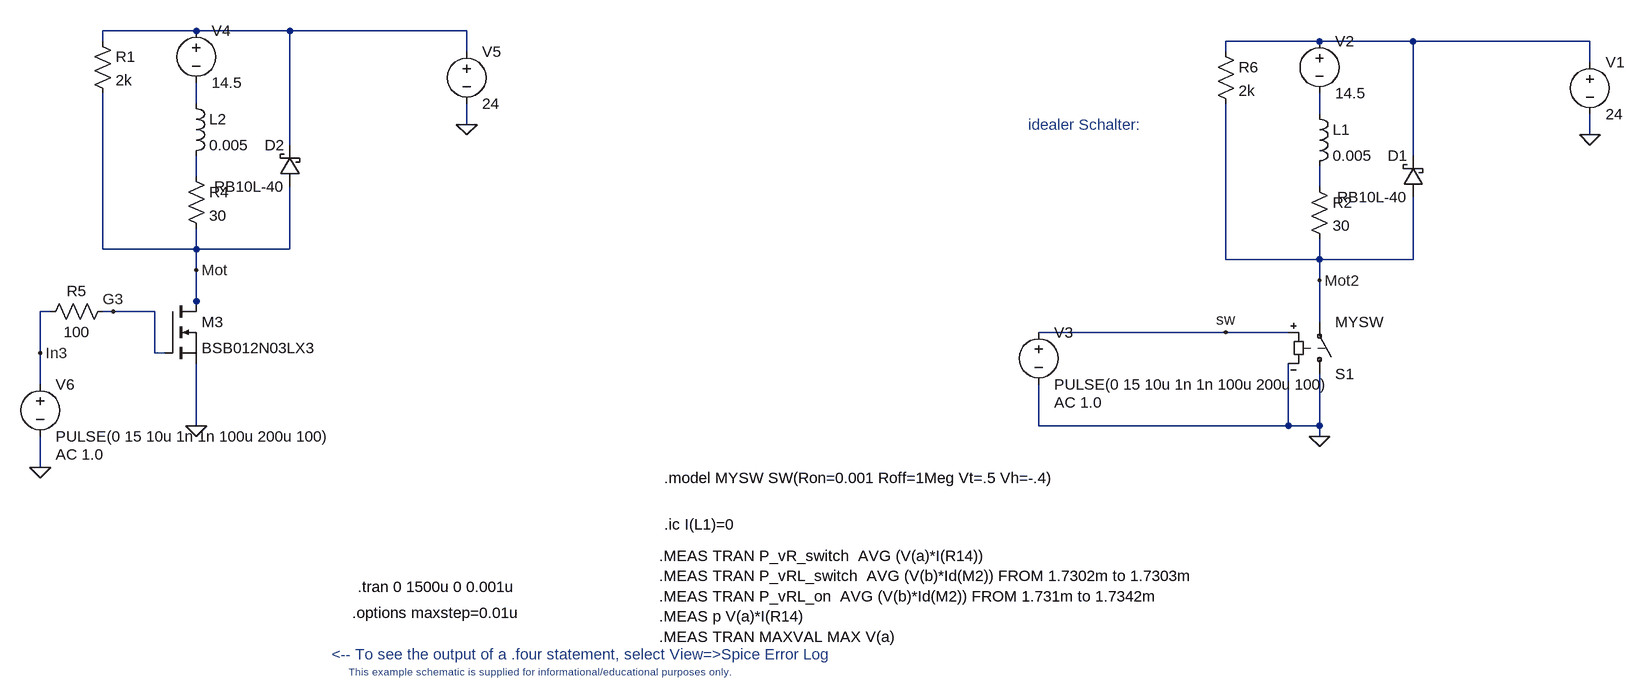
[diagram p0: schematic FetSwitchMotFH1.asc]
FetSwitchMotFH1.asc, the LTspice schematic file:
Version 4
SHEET 1 2516 2032
WIRE -1744 -176 -1888 -176
WIRE -1600 -176 -1744 -176
WIRE -1328 -176 -1600 -176
WIRE -1888 -160 -1888 -176
WIRE -16 -160 -160 -160
WIRE 128 -160 -16 -160
WIRE 400 -160 128 -160
WIRE -1328 -144 -1328 -176
WIRE -160 -144 -160 -160
WIRE 400 -128 400 -160
WIRE -1744 -64 -1744 -96
WIRE -16 -48 -16 -80
WIRE -1328 -32 -1328 -64
WIRE 400 -16 400 -48
WIRE -1600 0 -1600 -176
WIRE 128 16 128 -160
WIRE -1744 48 -1744 16
WIRE -16 64 -16 32
WIRE -1888 160 -1888 -80
WIRE -1744 160 -1744 128
WIRE -1744 160 -1888 160
WIRE -1600 160 -1600 64
WIRE -1600 160 -1744 160
WIRE -160 176 -160 -64
WIRE -16 176 -16 144
WIRE -16 176 -160 176
WIRE 128 176 128 80
WIRE 128 176 -16 176
WIRE -1744 192 -1744 160
WIRE -16 208 -16 176
WIRE -1744 240 -1744 192
WIRE -1968 256 -1984 256
WIRE -1872 256 -1888 256
WIRE -1808 256 -1872 256
WIRE -1744 256 -1744 240
WIRE -16 272 -16 208
WIRE -160 288 -448 288
WIRE -64 288 -160 288
WIRE -1984 320 -1984 256
WIRE -1808 320 -1808 256
WIRE -1792 320 -1808 320
WIRE -1984 368 -1984 320
WIRE -1744 432 -1744 336
WIRE -448 432 -448 368
WIRE -64 432 -64 336
WIRE -64 432 -448 432
WIRE -16 432 -16 352
WIRE -16 432 -64 432
WIRE -16 448 -16 432
WIRE -1984 496 -1984 448
FLAG -1328 -32 0
FLAG -1744 432 0
FLAG -1744 192 Mot
FLAG -1872 256 G3
FLAG -1984 496 0
FLAG -1984 320 In3
FLAG 400 -16 0
FLAG -16 448 0
FLAG -16 208 Mot2
FLAG -160 288 sw
SYMBOL VOLTAGE -1328 -160 R0
WINDOW 123 0 0 Left 2
WINDOW 39 0 0 Left 2
SYMATTR InstName V5
SYMATTR Value 24
SYMBOL res -1760 32 R0
SYMATTR InstName R4
SYMATTR Value 30
SYMBOL res -1872 240 R90
WINDOW 0 0 56 VBottom 2
WINDOW 3 32 56 VTop 2
SYMATTR InstName R5
SYMATTR Value 100
SYMBOL nmos -1792 240 R0
SYMATTR InstName M3
SYMATTR Value BSB012N03LX3
SYMBOL ind -1760 -80 R0
SYMATTR InstName L2
SYMATTR Value 0.005
SYMATTR SpiceLine Ipk=9
SYMBOL schottky -1584 64 R180
WINDOW 0 24 64 Left 2
WINDOW 3 24 0 Left 2
SYMATTR InstName D2
SYMATTR Value RB10L-40
SYMATTR Description Diode
SYMATTR Type diode
SYMBOL VOLTAGE -1744 -192 R0
WINDOW 123 0 0 Left 2
WINDOW 39 0 0 Left 2
SYMATTR InstName V4
SYMATTR Value 14.5
SYMBOL voltage -1984 352 R0
WINDOW 123 24 124 Left 2
WINDOW 39 0 0 Left 2
SYMATTR Value2 AC 1.0
SYMATTR InstName V6
SYMATTR Value PULSE(0 15 10u 1n 1n 100u 200u 100)
SYMBOL res -1904 -176 R0
SYMATTR InstName R1
SYMATTR Value 2k
SYMBOL VOLTAGE 400 -144 R0
WINDOW 123 0 0 Left 2
WINDOW 39 0 0 Left 2
SYMATTR InstName V1
SYMATTR Value 24
SYMBOL res -32 48 R0
SYMATTR InstName R2
SYMATTR Value 30
SYMBOL ind -32 -64 R0
SYMATTR InstName L1
SYMATTR Value 0.005
SYMATTR SpiceLine Ipk=9
SYMBOL schottky 144 80 R180
WINDOW 0 24 64 Left 2
WINDOW 3 24 0 Left 2
SYMATTR InstName D1
SYMATTR Value RB10L-40
SYMATTR Description Diode
SYMATTR Type diode
SYMBOL VOLTAGE -16 -176 R0
WINDOW 123 0 0 Left 2
WINDOW 39 0 0 Left 2
SYMATTR InstName V2
SYMATTR Value 14.5
SYMBOL voltage -448 272 R0
WINDOW 123 24 124 Left 2
WINDOW 39 0 0 Left 2
SYMATTR Value2 AC 1.0
SYMATTR InstName V3
SYMATTR Value PULSE(0 15 10u 1n 1n 100u 200u 100)
SYMBOL res -176 -160 R0
SYMATTR InstName R6
SYMATTR Value 2k
SYMBOL sw -16 368 M180
SYMATTR InstName S1
SYMATTR Value MYSW
TEXT -1496 680 Left 2 !.tran 0 1500u 0 0.001u
TEXT -1504 720 Left 2 !.options maxstep=0.01u
TEXT -1224 800 Top 1 ;This example schematic is supplied for informational/educational purposes only.
TEXT -1536 784 Left 2 ;<-- To see the output of a .four statement, select View=>Spice Error Log
TEXT -1032 632 Left 2 !.MEAS TRAN P_vR_switch  AVG (V(a)*I(R14)) \n.MEAS TRAN P_vRL_switch  AVG (V(b)*Id(M2)) FROM 1.7302m to 1.7303m\n.MEAS TRAN P_vRL_on  AVG (V(b)*Id(M2)) FROM 1.731m to 1.7342m\n.MEAS p V(a)*I(R14)\n.MEAS TRAN MAXVAL MAX V(a)
TEXT -1024 584 Left 2 !.ic I(L1)=0
TEXT -1024 512 Left 2 !.model MYSW SW(Ron=0.001 Roff=1Meg Vt=.5 Vh=-.4)
TEXT -464 -32 Left 2 ;idealer Schalter:

The netlist it stands for:
* FetSwitchMotFH1.asc
V5 N001 0 24
R4 N005 Mot 30
R5 G3 In3 100
M3 Mot G3 0 0 BSB012N03LX3
L2 N003 N005 0.005 Ipk=9
D2 Mot N001 RB10L-40
V4 N001 N003 14.5
V6 In3 0 PULSE(0 15 10u 1n 1n 100u 200u 100) AC 1.0
R1 N001 Mot 2k
V1 N002 0 24
R2 N006 Mot2 30
L1 N004 N006 0.005 Ipk=9
D1 Mot2 N002 RB10L-40
V2 N002 N004 14.5
V3 sw 0 PULSE(0 15 10u 1n 1n 100u 200u 100) AC 1.0
R6 N002 Mot2 2k
S1 0 Mot2 sw 0 MYSW
.model D D
.lib standard.dio
.model NMOS NMOS
.model PMOS PMOS
.lib standard.mos
.tran 0 1500u 0 0.001u
.options maxstep=0.01u
* This example schematic is supplied for informational/educational purposes only.
* <-- To see the output of a .four statement, select View=>Spice Error Log
.MEAS TRAN P_vR_switch  AVG (V(a)*I(R14))
.MEAS TRAN P_vRL_switch  AVG (V(b)*Id(M2)) FROM 1.7302m to 1.7303m
.MEAS TRAN P_vRL_on  AVG (V(b)*Id(M2)) FROM 1.731m to 1.7342m
.MEAS p V(a)*I(R14)
.MEAS TRAN MAXVAL MAX V(a)
.ic I(L1)=0
.model MYSW SW(Ron=0.001 Roff=1Meg Vt=.5 Vh=-.4)
* idealer Schalter:
.backanno
.end